# Altium schematic sheet sunalsorises.SchDoc
size 228 x 152 mm
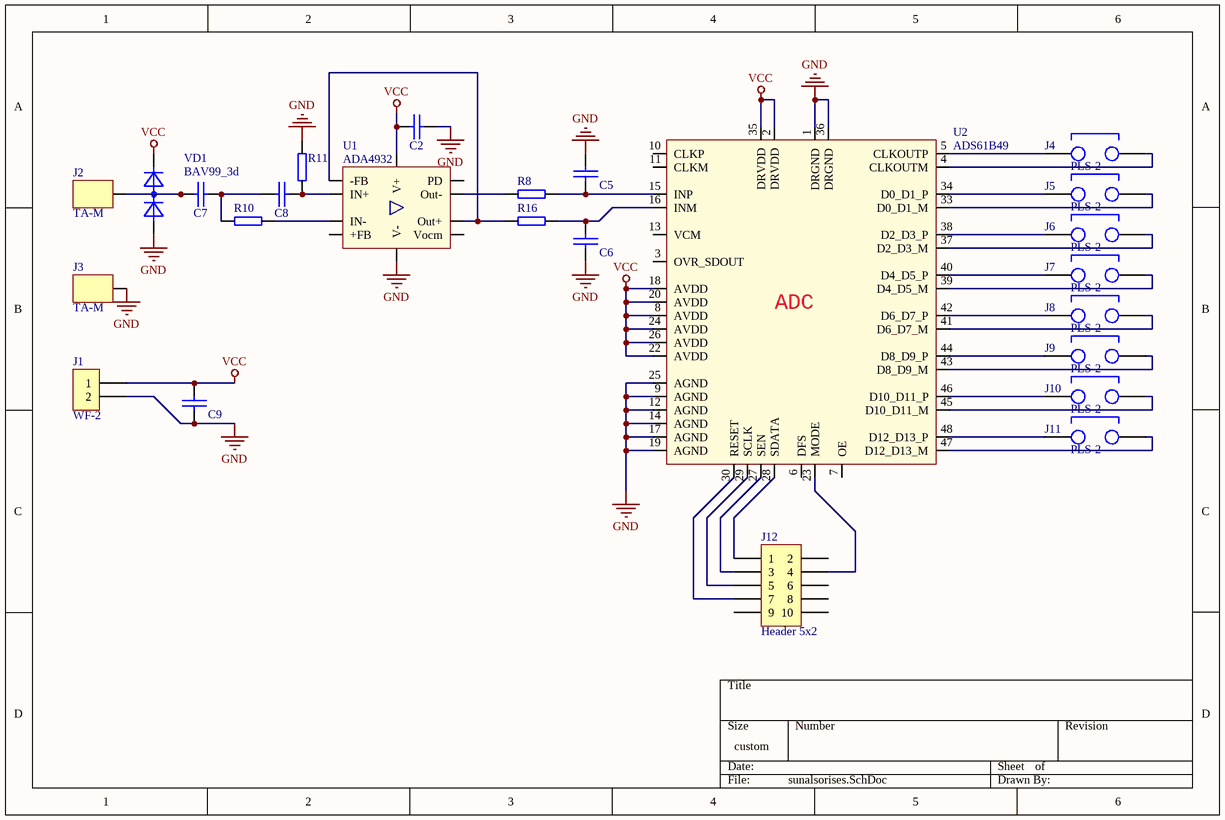
[diagram p0: sunalsorises.SchDoc]

## Parts
C2  CAP_0805  [CAP_0805]  (value not drawn)
C5  CAP_0805  [CAP_0805]  (value not drawn)
C6  CAP_0805  [CAP_0805]  (value not drawn)
C7  CAP_0805  [CAP_0805]  (value not drawn)
C8  CAP_0805  [CAP_0805]  (value not drawn)
C9  CAP_0805  [CAP_0805]  (value not drawn)
J1  WF-2  [WF-2]
J2  TA-M  [TA-M]
J3  TA-M  [TA-M]
J4  PLS-2  [PLS-2]
J5  PLS-2  [PLS-2]
J6  PLS-2  [PLS-2]
J7  PLS-2  [PLS-2]
J8  PLS-2  [PLS-2]
J9  PLS-2  [PLS-2]
J10  PLS-2  [PLS-2]
J11  PLS-2  [PLS-2]
J12  Header 5x2  [Header 5x2]
R8  (no value)  [RES_0805]
R10  (no value)  [RES_0805]
R11  (no value)  [RES_0805]
R16  (no value)  [RES_0805]
U1  ADA4932  [ADA4932]
U2  ADS61B49  [ADS61B49]
VD1  BAV99_3d  [SOT-23 - 3d]

## Nets
GND: C2.2 C5.1 C6.2 C9.2 J1.2 J3.1 R11.2 U1.13(V-) U2.1(DRGND) U2.9(AGND) U2.12(AGND) U2.14(AGND) U2.17(AGND) U2.19(AGND) U2.25(AGND) U2.36(DRGND) VD1.1
VCC: C2.1 C9.1 J1.1 U1.5(V+) U2.2(DRVDD) U2.8(AVDD) U2.18(AVDD) U2.20(AVDD) U2.22(AVDD) U2.24(AVDD) U2.26(AVDD) U2.35(DRVDD) VD1.2
NetC5_2: C5.2 R8.2 U2.15(INP)
NetC6_1: C6.1 R16.2 U2.16(INM)
NetC7_1: C7.1 J2.1 VD1.3
NetC7_2: C7.2 C8.1 R10.1
NetC8_2: C8.2 R11.1 U1.2(IN+)
NetJ4_1: J4.1 U2.5(CLKOUTP)
NetJ4_2: J4.2 U2.4(CLKOUTM)
NetJ5_1: J5.1 U2.34(D0_D1_P)
NetJ5_2: J5.2 U2.33(D0_D1_M)
NetJ6_1: J6.1 U2.38(D2_D3_P)
NetJ6_2: J6.2 U2.37(D2_D3_M)
NetJ7_1: J7.1 U2.40(D4_D5_P)
NetJ7_2: J7.2 U2.39(D4_D5_M)
NetJ8_1: J8.1 U2.42(D6_D7_P)
NetJ8_2: J8.2 U2.41(D6_D7_M)
NetJ9_1: J9.1 U2.44(D8_D9_P)
NetJ9_2: J9.2 U2.43(D8_D9_M)
NetJ10_1: J10.1 U2.46(D10_D11_P)
NetJ10_2: J10.2 U2.45(D10_D11_M)
NetJ11_1: J11.1 U2.48(D12_D13_P)
NetJ11_2: J11.2 U2.47(D12_D13_M)
NetJ12_1: J12.1 U2.28(SDATA)
NetJ12_3: J12.3 U2.27(SEN)
NetJ12_4: J12.4 U2.23(MODE)
NetJ12_5: J12.5 U2.29(SCLK)
NetJ12_7: J12.7 U2.30(RESET)
NetR8_1: R8.1 U1.11(Out-)
NetR10_2: R10.2 U1.3(IN-)
NetR16_1: R16.1 U1.1(-FB) U1.10(Out+)

Not connected (* = marked no-connect by the designer): J12 2 6 8 9 10; U1 4(+FB) 9(Vocm) 12(PD); U2 3(OVR_SDOUT) 6(DFS) 7(OE) 10(CLKP) 11(CLKM) 13(VCM)

## Notes on the sheet
- (in symbol ADS61B49) ADC

## Library data of the parts
R8 R10 R11 R16 = RES_0805